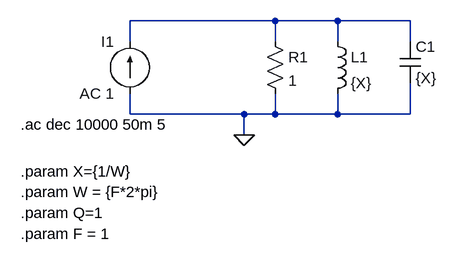
[diagram p0: schematic Circuito RLC  (Paralelo).asc]
Circuito RLC  (Paralelo).asc, the LTspice schematic file:
Version 4
SHEET 1 880 680
WIRE 272 96 48 96
WIRE 368 96 272 96
WIRE 480 96 368 96
WIRE 48 128 48 96
WIRE 272 128 272 96
WIRE 368 128 368 96
WIRE 480 128 480 96
WIRE 48 240 48 208
WIRE 224 240 48 240
WIRE 272 240 272 208
WIRE 272 240 224 240
WIRE 368 240 368 208
WIRE 368 240 272 240
WIRE 480 240 480 192
WIRE 480 240 368 240
WIRE 224 272 224 240
FLAG 224 272 0
SYMBOL res 256 112 R0
SYMATTR InstName R1
SYMATTR Value 1
SYMBOL cap 464 128 R0
SYMATTR InstName C1
SYMATTR Value {X}
SYMBOL ind 352 112 R0
SYMATTR InstName L1
SYMATTR Value {X}
SYMBOL current 48 208 R180
WINDOW 0 24 80 Left 2
WINDOW 3 24 0 Left 2
SYMATTR InstName I1
SYMATTR Value AC 1
TEXT -120 424 Left 2 !.param F = 1
TEXT -120 328 Left 2 !.param X={1/W}
TEXT -120 360 Left 2 !.param W = {F*2*pi}
TEXT -120 392 Left 2 !.param Q=1
TEXT -120 256 Left 2 !.ac dec 10000 50m 5

The netlist it stands for:
* Circuito RLC  (Paralelo).asc
R1 N001 0 1
C1 N001 0 {X}
L1 N001 0 {X}
I1 0 N001 AC 1
.param F = 1
.param X={1/W}
.param W = {F*2*pi}
.param Q=1
.ac dec 10000 50m 5
.backanno
.end